# Altium schematic sheet SoC.SchDoc: NRF5340 SoC, BLE Antenna
size A3; SheetNumber: 2; SheetTotal: 6; FileInfo: SoC.SchDoc
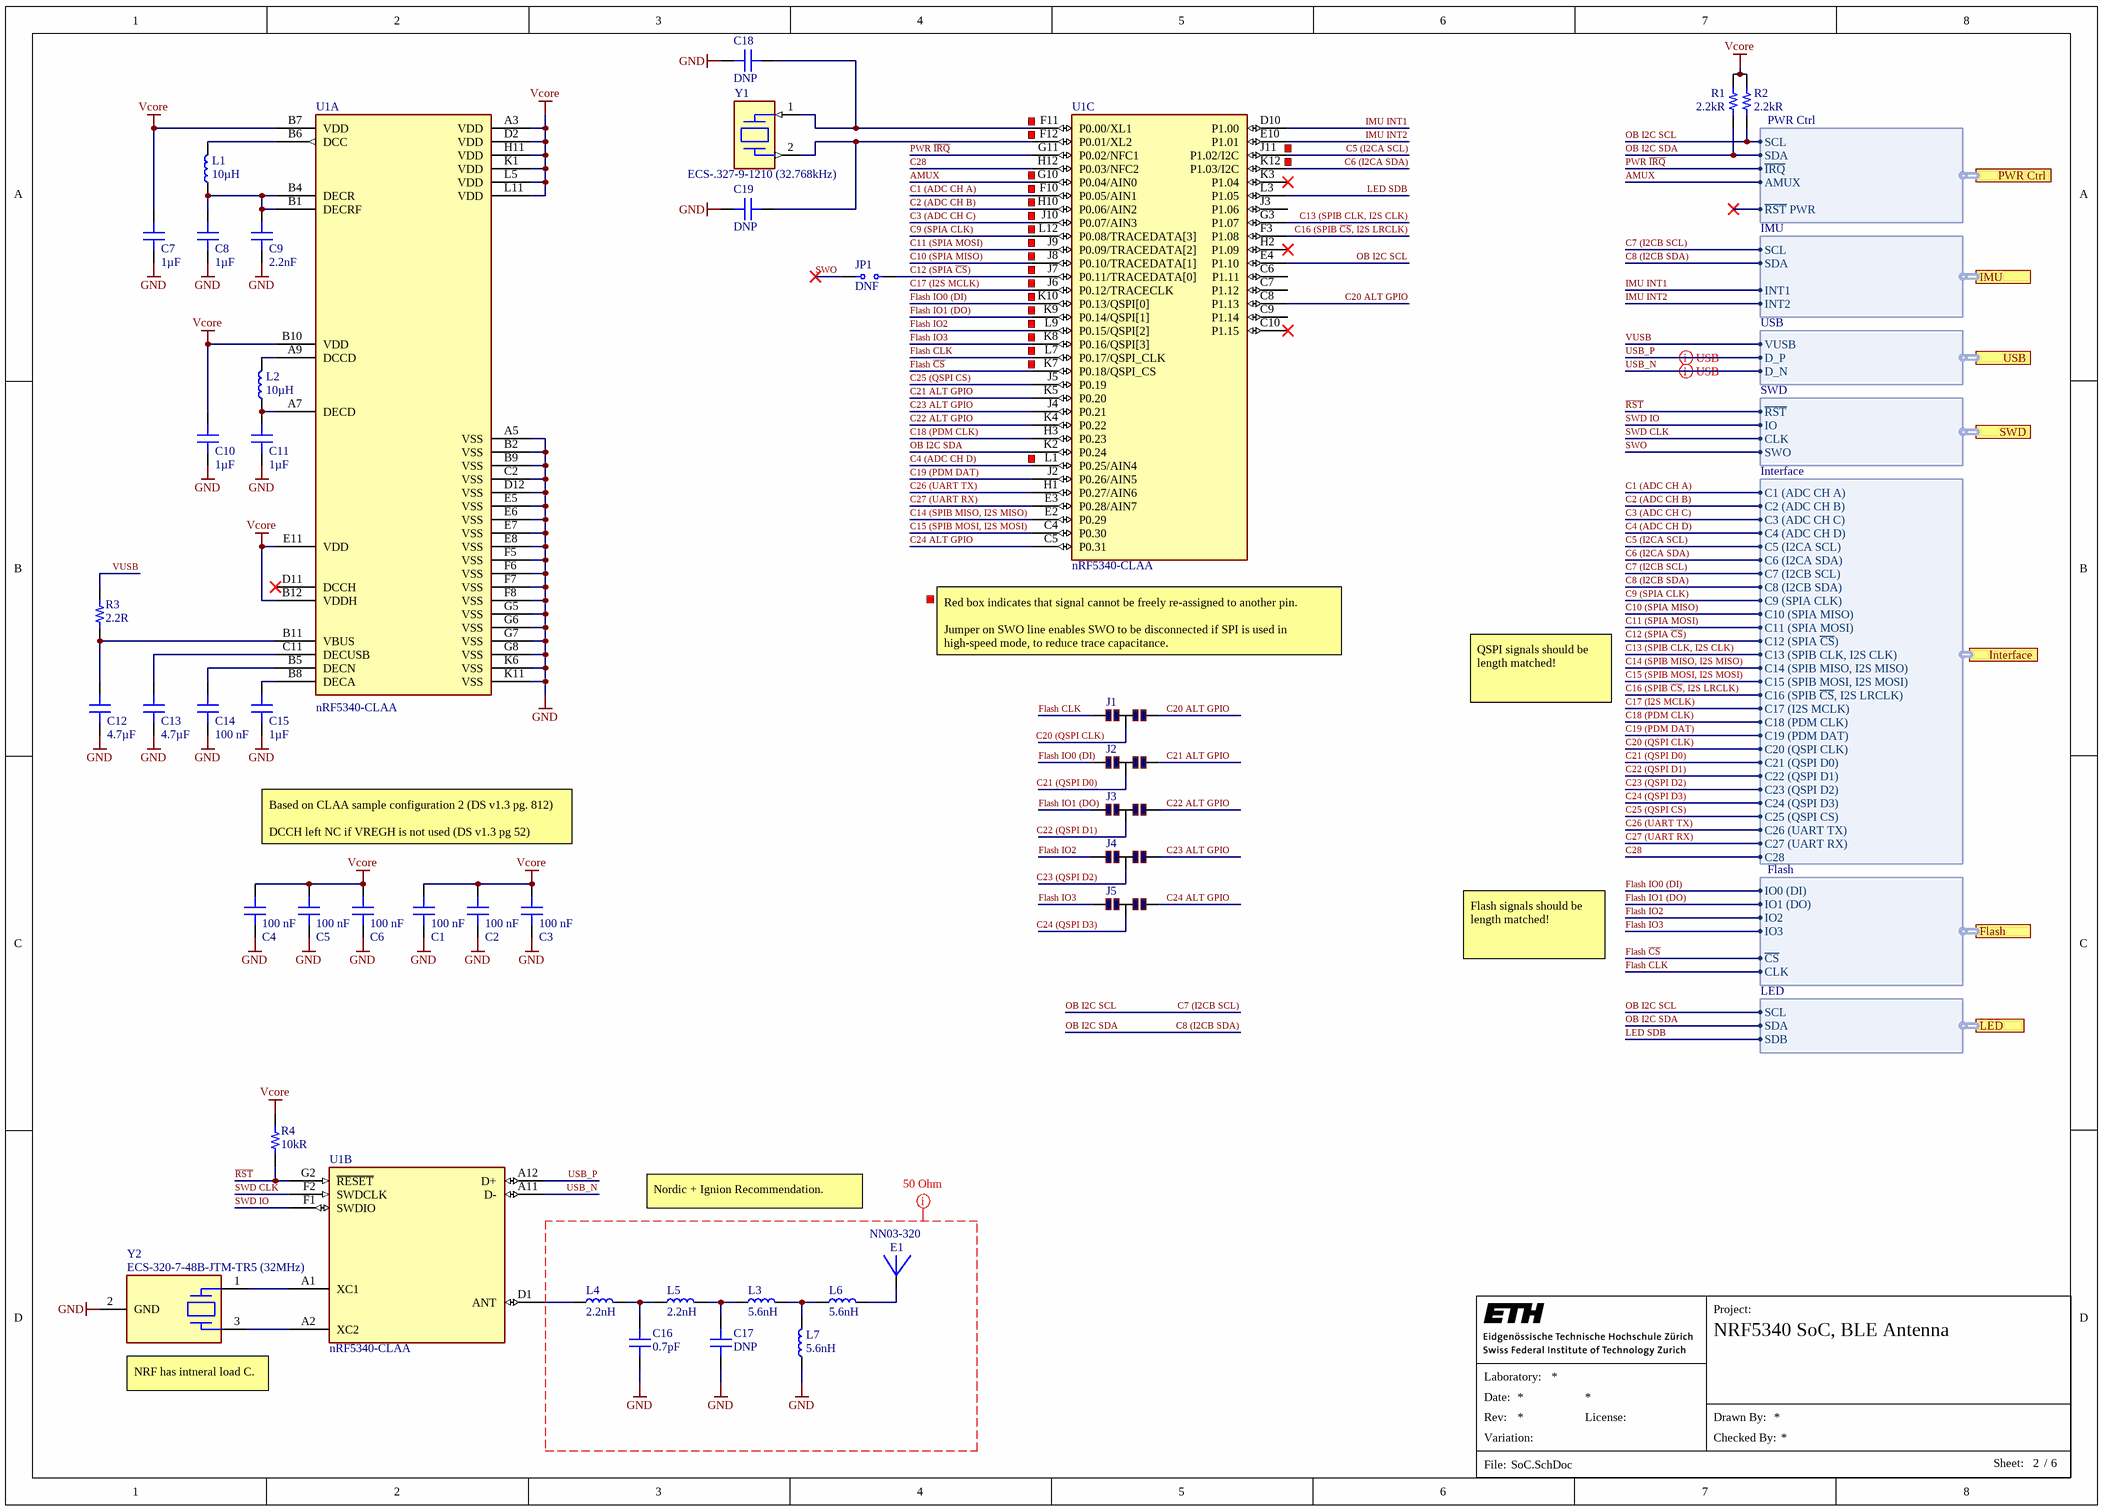
[diagram p0: SoC.SchDoc]

## Parts
C1  100 nF  [CAP_0201]
C2  100 nF  [CAP_0201]
C3  100 nF  [CAP_0201]
C4  100 nF  [CAP_0201]
C5  100 nF  [CAP_0201]
C6  100 nF  [CAP_0201]
C7  1µF  [CAP_0201]
C8  1µF  [CAP_0201]
C9  2.2nF  [CAP_0201]
C10  1µF  [CAP_0201]
C11  1µF  [CAP_0201]
C12  4.7µF  [CAP_0402]
C13  4.7µF  [CAP_0402]
C14  100 nF  [CAP_0201]
C15  1µF  [CAP_0201]
C16  0.7pF  [CAP_0201]
C17  DNP  [CAP_0201_DNP]  (no BOM)
C18  DNP  [CAP_0201_DNP]  (no BOM)
C19  DNP  [CAP_0201_DNP]  (no BOM)
E1  NN03-320  [NN03-320]
J1  Solder Jumper  [JMP_0201_3WAY]  (value not drawn)
J2  Solder Jumper  [JMP_0201_3WAY]  (value not drawn)
J3  Solder Jumper  [JMP_0201_3WAY]  (value not drawn)
J4  Solder Jumper  [JMP_0201_3WAY]  (value not drawn)
J5  Solder Jumper  [JMP_0201_3WAY]  (value not drawn)
JP1  DNF  [JMP_0201]  (no BOM)
L1  10µH  [IND_0603]
L2  10µH  [IND_0603]
L3  5.6nH  [IND_0201_MURATA_LQW03AW]
L4  2.2nH  [IND_0201_MURATA_LQW03AW]
L5  2.2nH  [IND_0201_MURATA_LQW03AW]
L6  5.6nH  [IND_0201_MURATA_LQW03AW]
L7  5.6nH  [IND_0201_MURATA_LQW03AW]
R1  2.2kR  [RES_0201]
R2  2.2kR  [RES_0201]
R3  2.2R  [RES_0201]
R4  10kR  [RES_0201]
U1  nRF5340-CLAA  [NRF5340_WLCSP]  (parts A,B,C of 3)
Y1  ECS-.327-9-1210 (32.768kHz)  [Y_ECX-1210]
Y2  ECS-320-7-48B-JTM-TR5 (32MHz)  [Y_ECX-1048]

## Ports
Flash (harness Flash), IMU (harness IMU), Interface (harness Interface), LED (harness LED), PWR Ctrl (harness PWR Ctrl), SWD (harness SWD), USB (harness USB)

## Harnesses
SWD: ~{RST}, IO, CLK, SWO
IMU: SCL, SDA, INT1, INT2
PWR Ctrl: SDA, SCL, AMUX, ~{IRQ}, ~{RST} PWR
LED: SCL, SDA, SDB
USB: VUSB, D_P, D_N
Interface: C1 (ADC CH A), C2 (ADC CH B), C3 (ADC CH C), C4 (ADC CH D), C5 (I2CA SCL), C6 (I2CA SDA), C7 (I2CB SCL), C8 (I2CB SDA), C9 (SPIA CLK), C10 (SPIA MISO), C11 (SPIA MOSI), C12 (SPIA ~{CS}), C14 (SPIB MISO, I2S MISO), C15 (SPIB MOSI, I2S MOSI), C16 (SPIB ~{CS}, I2S LRCLK), C17 (I2S MCLK), C18 (PDM CLK), C19 (PDM DAT), C20 (QSPI CLK), C21 (QSPI D0), C22 (QSPI D1), C23 (QSPI D2), C24 (QSPI D3), C25 (QSPI CS), C26 (UART TX), C27 (UART RX), C13 (SPIB CLK, I2S CLK), C28
Flash: IO0 (DI), IO1 (DO), IO2, IO3, ~{CS}, CLK

## Nets
GND: C1.1 C2.1 C3.1 C4.1 C5.1 C6.1 C7.1 C8.1 C9.1 C10.1 C11.1 C12.1 C13.1 C14.1 C15.1 C16.1 C17.1 C18.1 C19.1 L7.1 U1.A5(VSS) U1.B2(VSS) U1.B9(VSS) U1.C2(VSS) U1.D12(VSS) U1.E5(VSS) U1.E6(VSS) U1.E7(VSS) U1.E8(VSS) U1.F5(VSS) U1.F6(VSS) U1.F7(VSS) U1.F8(VSS) U1.G5(VSS) U1.G6(VSS) U1.G7(VSS) U1.G8(VSS) U1.K6(VSS) U1.K11(VSS) Y2.2(GND)
Vcore: C1.2 C2.2 C3.2 C4.2 C5.2 C6.2 C7.2 C10.2 R1.1 R2.2 R4.2 U1.A3(VDD) U1.B7(VDD) U1.B10(VDD) U1.B12(VDDH) U1.D2(VDD) U1.E11(VDD) U1.H11(VDD) U1.K1(VDD) U1.L5(VDD) U1.L11(VDD)
AMUX: U1.G10(P0.04/AIN0) ; port PWR Ctrl.AMUX
C1 (ADC CH A): U1.F10(P0.05/AIN1) ; port Interface.C1 (ADC CH A)
C2 (ADC CH B): U1.H10(P0.06/AIN2) ; port Interface.C2 (ADC CH B)
C3 (ADC CH C): U1.J10(P0.07/AIN3) ; port Interface.C3 (ADC CH C)
C4 (ADC CH D): U1.L1(P0.25/AIN4) ; port Interface.C4 (ADC CH D)
C5 (I2CA SCL): U1.J11(P1.02/I2C) ; port Interface.C5 (I2CA SCL)
C6 (I2CA SDA): U1.K12(P1.03/I2C) ; port Interface.C6 (I2CA SDA)
C7 (I2CB SCL): R2.1 U1.E4(P1.10) ; port IMU.SCL, port PWR Ctrl.SCL, port LED.SCL, port Interface.C7 (I2CB SCL)  [also labelled OB I2C SCL]
C8 (I2CB SDA): R1.2 U1.K2(P0.24) ; port IMU.SDA, port PWR Ctrl.SDA, port LED.SDA, port Interface.C8 (I2CB SDA)  [also labelled OB I2C SDA]
C9 (SPIA CLK): U1.L12(P0.08/TRACEDATA[3]) ; port Interface.C9 (SPIA CLK)
C10 (SPIA MISO): U1.J8(P0.10/TRACEDATA[1]) ; port Interface.C10 (SPIA MISO)
C11 (SPIA MOSI): U1.J9(P0.09/TRACEDATA[2]) ; port Interface.C11 (SPIA MOSI)
C12 (SPIA ~{CS}): JP1.2 U1.J7(P0.11/TRACEDATA[0]) ; port Interface.C12 (SPIA ~{CS})
C13 (SPIB CLK, I2S CLK): U1.G3(P1.07) ; port Interface.C13 (SPIB CLK, I2S CLK)
C14 (SPIB MISO, I2S MISO): U1.E2(P0.29) ; port Interface.C14 (SPIB MISO, I2S MISO)
C15 (SPIB MOSI, I2S MOSI): U1.C4(P0.30) ; port Interface.C15 (SPIB MOSI, I2S MOSI)
C16 (SPIB ~{CS}, I2S LRCLK): U1.F3(P1.08) ; port Interface.C16 (SPIB ~{CS}, I2S LRCLK)
C17 (I2S MCLK): U1.J6(P0.12/TRACECLK) ; port Interface.C17 (I2S MCLK)
C18 (PDM CLK): U1.H3(P0.23) ; port Interface.C18 (PDM CLK)
C19 (PDM DAT): U1.J2(P0.26/AIN5) ; port Interface.C19 (PDM DAT)
C20 (QSPI CLK): J1.2 ; port Interface.C20 (QSPI CLK)
C20 ALT GPIO: J1.3 U1.C8(P1.13)
C21 (QSPI D0): J2.2 ; port Interface.C21 (QSPI D0)
C21 ALT GPIO: J2.3 U1.K5(P0.20)
C22 (QSPI D1): J3.2 ; port Interface.C22 (QSPI D1)
C22 ALT GPIO: J3.3 U1.K4(P0.22)
C23 (QSPI D2): J4.2 ; port Interface.C23 (QSPI D2)
C23 ALT GPIO: J4.3 U1.J4(P0.21)
C24 (QSPI D3): J5.2 ; port Interface.C24 (QSPI D3)
C24 ALT GPIO: J5.3 U1.C5(P0.31)
C25 (QSPI CS): U1.J5(P0.19) ; port Interface.C25 (QSPI CS)
C26 (UART TX): U1.H1(P0.27/AIN6) ; port Interface.C26 (UART TX)
C27 (UART RX): U1.E3(P0.28/AIN7) ; port Interface.C27 (UART RX)
C28: U1.H12(P0.03/NFC2) ; port Interface.C28
Flash ~{CS}: U1.K7(P0.18/QSPI_CS) ; port Flash.~{CS}
Flash CLK: J1.1 U1.L7(P0.17/QSPI_CLK) ; port Flash.CLK
Flash IO0 (DI): J2.1 U1.K10(P0.13/QSPI[0]) ; port Flash.IO0 (DI)
Flash IO1 (DO): J3.1 U1.K9(P0.14/QSPI[1]) ; port Flash.IO1 (DO)
Flash IO2: J4.1 U1.L9(P0.15/QSPI[2]) ; port Flash.IO2
Flash IO3: J5.1 U1.K8(P0.16/QSPI[3]) ; port Flash.IO3
IMU INT1: U1.D10(P1.00) ; port IMU.INT1
IMU INT2: U1.E10(P1.01) ; port IMU.INT2
LED SDB: U1.L3(P1.05) ; port LED.SDB
PWR ~{IRQ}: U1.G11(P0.02/NFC1) ; port PWR Ctrl.~{IRQ}
~{RST}: R4.1 U1.G2(~{RESET}) ; port SWD.~{RST}
SWD CLK: U1.F2(SWDCLK) ; port SWD.CLK
SWD IO: U1.F1(SWDIO) ; port SWD.IO
SWO: JP1.1 ; port SWD.SWO
USB_N: U1.A11(D-) ; port USB.D_N
USB_P: U1.A12(D+) ; port USB.D_P
VUSB: R3.1 ; port USB.VUSB
NetC8_2: C8.2 C9.2 L1.1 U1.B1(DECRF) U1.B4(DECR)
NetC11_2: C11.2 L2.1 U1.A7(DECD)
NetC12_2: C12.2 R3.2 U1.B11(VBUS)
NetC13_2: C13.2 U1.C11(DECUSB)
NetC14_2: C14.2 U1.B5(DECN)
NetC15_2: C15.2 U1.B8(DECA)
NetC16_2: C16.2 L4.2 L5.1
NetC17_2: C17.2 L3.1 L5.2
NetC18_2: C18.2 U1.F11(P0.00/XL1) Y1.1
NetC19_2: C19.2 U1.F12(P0.01/XL2) Y1.2
NetE1_1: E1.1 L6.2
NetL1_2: L1.2 U1.B6(DCC)
NetL2_2: L2.2 U1.A9(DCCD)
NetL3_2: L3.2 L6.1 L7.2
NetL4_1: L4.1 U1.D1(ANT)
NetU1_A1: U1.A1(XC1) Y2.1
NetU1_A2: U1.A2(XC2) Y2.3

Not connected (* = marked no-connect by the designer): U1 C6(P1.11) C7(P1.12) C9(P1.14) C10(P1.15)* D11(DCCH)* H2(P1.09)* J3(P1.06) K3(P1.04)*

## Layout directives
net class 50OHM: GND
differential pair: USB_N, USB_P

## Notes on the sheet
- Red box indicates that signal cannot be freely re-assigned to another pin.
  Jumper on SWO line enables SWO to be disconnected if SPI is used in high-speed mode, to reduce trace capacitance.
- QSPI signals should be length matched!
- Based on CLAA sample configuration 2 (DS v1.3 pg. 812)
  DCCH left NC if VREGH is not used (DS v1.3 pg 52)
- Flash signals should be length matched!
- Nordic + Ignion Recommendation.
- (near Y2) NRF has intneral load C.
- Project:
- Laboratory:
- Date:
- File:
- Rev:
- Variation:
- License:
- Drawn By:
- Checked By:
- Sheet:
- /

## Library data of the parts
C1-C6 C14 = CAP_0201_100n_10V: CAP CER 0.1UF 10V X5R 0201; Manufacturer: Murata; Manufacturer Part Number: GRM033Z71A104KE14D; Supplier 1: Mouser; Supplier Part Number 1: 81-GRM033Z71A104KE4D
C7 C8 C10 C11 C15 = CAP_0201_1u_10V: CAP CER 1UF 10V X6S; Manufacturer: Murata; Manufacturer Part Number: GRM033C81A105ME05D; Supplier 1: Mouser; Supplier Part Number 1: 81-GRM033C81A105ME5D
C9 = CAP_0201_2.2n_16V: CAP CER 2.2NF 16V X7R 0201; Manufacturer: Murata; Manufacturer Part Number: GRM033R71C222KA88D; Supplier 1: Mouser; Supplier Part Number 1: 81-GRM033R71C222KA8D
C12 C13 = CAP_0402_4.7u_16V: CAP CER 4.7UF 16V X5R 0402; Manufacturer: Kyocera AVX; Manufacturer Part Number: 0402YD475MAT2A; Supplier 1: Mouser; Supplier Part Number 1: 581-0402YD475MAT2A
C16 = CAP_RF_0201_0.7pF: CAP RF CER 0.7PF 25V C0G 0201; Manufacturer: Murata; Manufacturer Part Number: GJM0335C1ER70BB01D; Supplier 1: Mouser; Supplier Part Number 1: 81-GJM0335C1ER70BB1D
C17-C19 = CAP_0201_DNP: CAP CER DNP 0201
E1 = NN03-320: Integrated Chip Antenna; Manufacturer: Fractus Antennas; Supplier 1: Mouser; Manufacturer Part Number: NN03-320; Supplier Part Number 1: 128-NN03-320
J1-J5 = JMP_0201_3WAY: Solder Jumper 3 Pads; Manufacturer Part Number: ERJ-1GN0R00C; Manufacturer: Panasonic; Supplier 1: Mouser; Supplier Part Number 1: 667-ERJ-1GN0R00C
JP1 = JMP_0201_DNF: JMP 0201 NO TRACE DNF
L1 L2 = L_0603_10uH_300mA: L 10uH 300mA 0603; Manufacturer: Murata; Manufacturer Part Number: LQM18DN100M70L; Supplier 1: Mouser; Supplier Part Number 1: 81-LQM18DN100M70L
L3 L6 L7 = L_RF_0201_5.6nH: L 5.6nH RF 0201; Manufacturer: Murata; Manufacturer Part Number: LQW03AW5N6J00D; Supplier 1: Mouser; Supplier Part Number 1: 81-LQW03AW5N6J00D
L4 L5 = L_RF_0201_2.2nH: L 2.2nH RF 0201; Manufacturer: Murata; Manufacturer Part Number: LQP03HQ2N2B02D; Supplier 1: Mouser; Supplier Part Number 1: 81-LQP03HQ2N2B02D
R1 R2 = R_0201_2.2K: R 2.2K 1% 50mW 0201; Manufacturer: Panasonic; Manufacturer Part Number: ERJ-1GNF2201C; Supplier 1: Mouser; Supplier Part Number 1: 667-ERJ-1GNF2201C
R3 = R_0201_2.2R: R 2.2R 1% 50mW 0201; Manufacturer: Yageo; Manufacturer Part Number: RC0201FR-072R2L; Supplier 1: Mouser; Supplier Part Number 1: 603-RC0201FR-072R2L
R4 = R_0201_10K: R 10K 1% 50mW 0201; Manufacturer: Panasonic; Manufacturer Part Number: ERJ-1GNF1002C; Supplier 1: Mouser; Supplier Part Number 1: 667-ERJ-1GNF1002C
U1 = nRF5340-CLAA: Multi-protocol Bluetooth Low Energy, IEEE 802.15.4, ANT and 2.4GHz proprietary system-on-chip; Manufacturer Part Number: NRF5340-CLAA-R7; Manufacturer: Nordic; Supplier 1: Mouser; Supplier Part Number 1: 949-NRF5340-CLAA-R7
Y1 = Y_ECS-327-9-1210: Crystal 32.768KHZ 9PFSMD ECX-1210 Khz Crystal 32.768KHZ 20PPM 90K Ohm -40C ~ 85C 2-SMD; Manufacturer: ECS International; Manufacturer Part Number: ECS-.327-9-1210-TR; Supplier 1: Mouser; Supplier Part Number 1: 520-.327-9-1210T
Y2 = Y_ECS-320-7-48B-JTM-TR5: Crystal 32MHz 7pF ±20ppm ±20ppm 4-Pin Ultraminiature CSMD T/R; Manufacturer: ECS International; Supplier 1: Mouser; Manufacturer Part Number: ECS-320-7-48B-JTM-TR5; Supplier Part Number 1: 520-ECS320748BJTMTR5